# EAGLE design LoliBot (EAGLE 8.3.2)
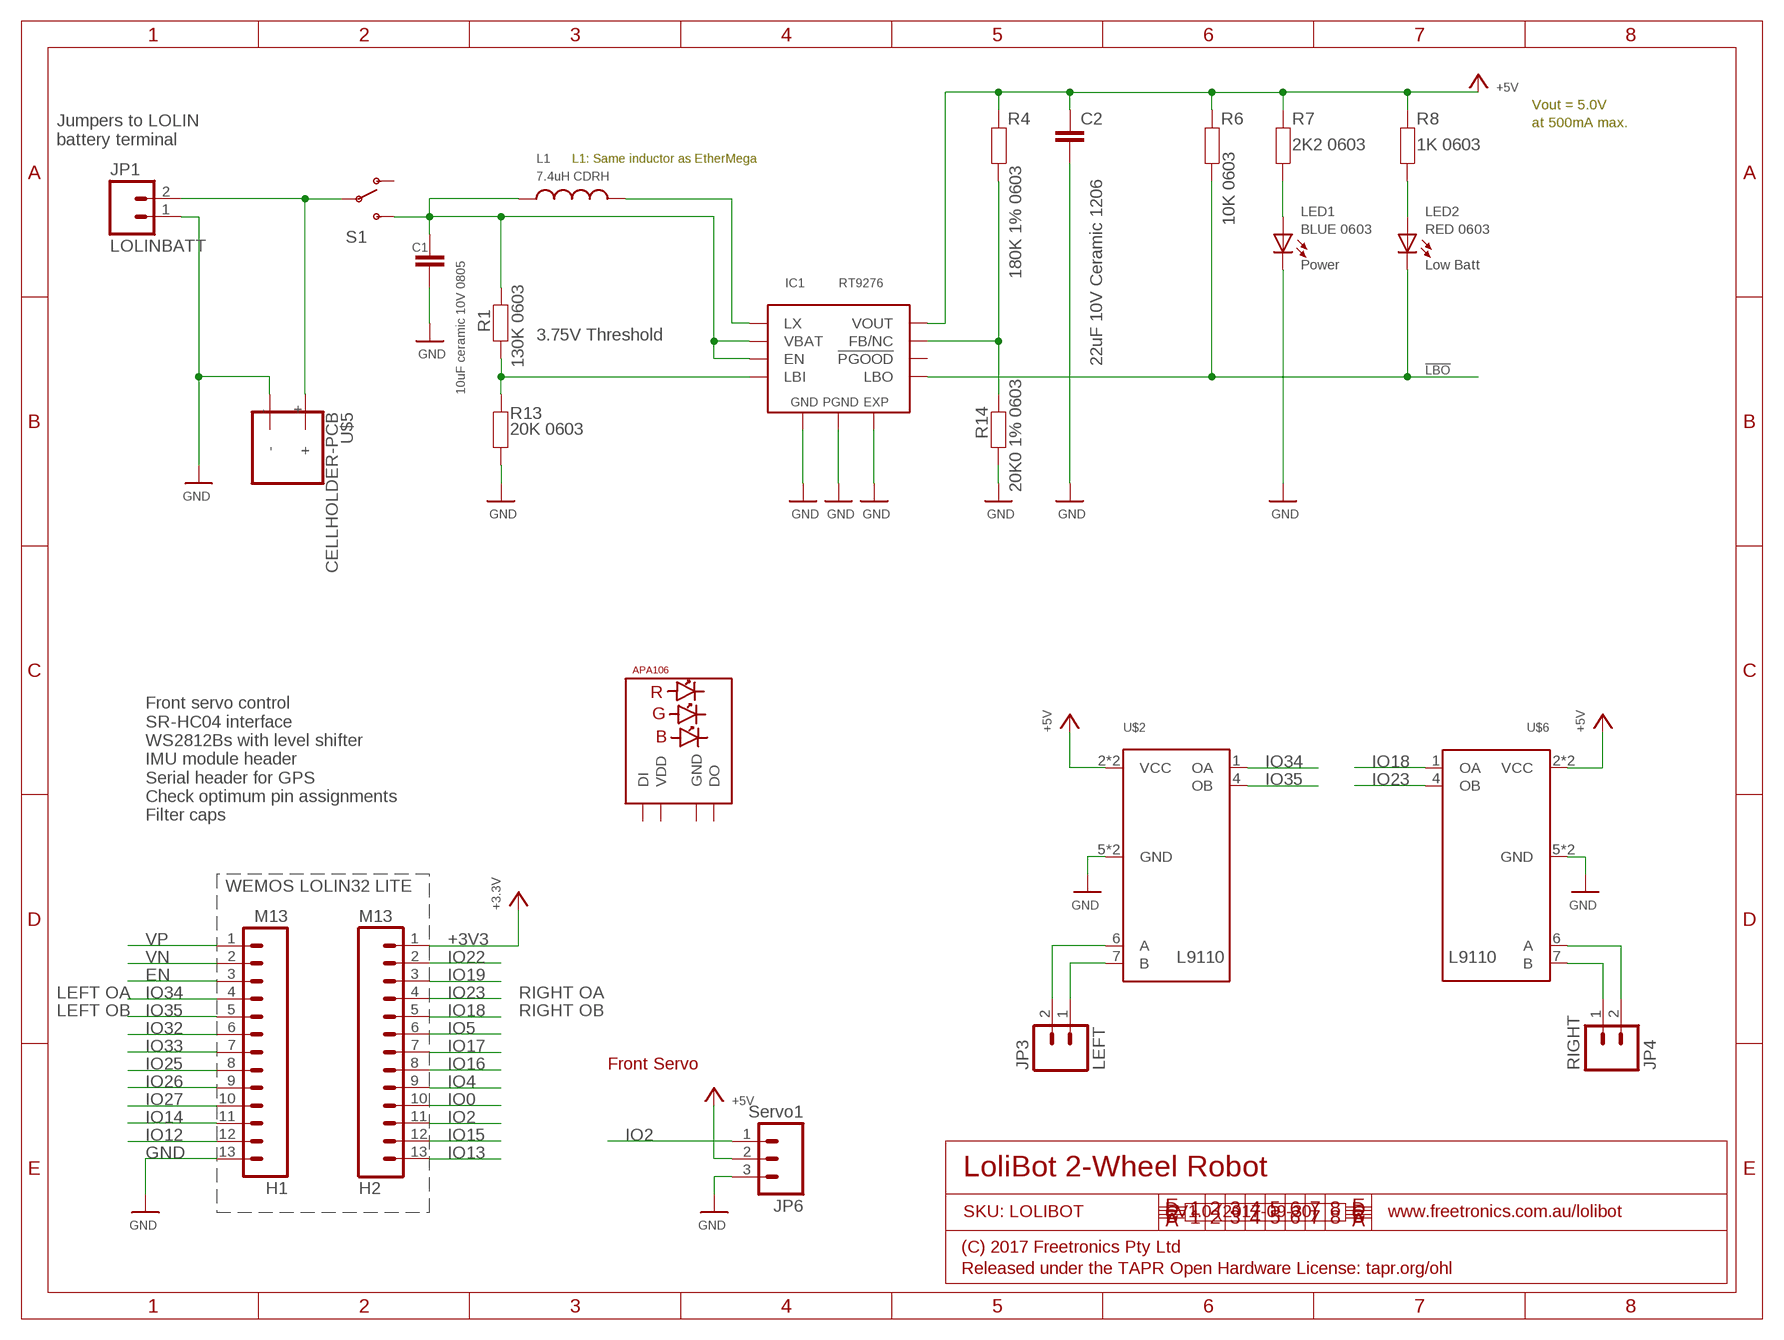
[diagram p0: schematic, sheet 1]

## Parts
C1  10uF ceramic 10V 0805  C-EUC0805  [C0805]
C2  22uF 10V Ceramic 1206  C-EUC1206K  [C1206K]
H1  M13  [1X13]
H2  M13  [1X13]
IC1  RT9276  [WDFN-10L-3X3]
JP1  LOLINBATT  M023.5MM  [SCREWTERMINAL-3.5MM-2]
JP3  LEFT  M023.5MM  [SCREWTERMINAL-3.5MM-2]
JP4  RIGHT  M023.5MM  [SCREWTERMINAL-3.5MM-2]
JP6  Servo1  M03PTH  [1X03]
L1  7.4uH CDRH  INDUCTOR  [CDRH]
LED1  BLUE 0603  LED0603  [LED-0603]
LED2  RED 0603  LED0603  [LED-0603]
R1  130K 0603  RESISTOR0603  [0603]
R4  180K 1% 0603  RESISTOR0603  [0603]
R6  10K 0603  RESISTOR0603  [0603]
R7  2K2 0603  RESISTOR0603  [0603]
R8  1K 0603  RESISTOR0603  [0603]
R13  20K 0603  RESISTOR0603  [0603]
R14  20K0 1% 0603  RESISTOR0603  [0603]
S1  SWITCH-SPSTPTH  [SWITCH-SPDT]
U$1  APA106F8  [LED8MMRGB]
U$2  L9110SO8  [SO08]
U$5  CELLHOLDER-PCB  [BH-18650-PC]
U$6  L9110SO8  [SO08]

## Nets
!LBO: IC1.4(LBO) LED2.C R6.2
+3V3: H2.1 ; supply symbol labelled +3.3V
+5V: C2.1 IC1.2(VOUT) JP6.2 R4.1 R6.1 R7.1 R8.1 U$2.2(VCC) U$2.3(VCC) U$6.2(VCC) U$6.3(VCC)
EN: H1.3
FB: IC1.3(FB/NC) R4.2 R14.2
GND: C1.2 C2.2 H1.13 IC1.5(GND) IC1.10(PGND) IC1.EXP JP1.1 JP6.3 LED1.C R13.1 R14.1 U$2.5(GND) U$2.8(GND) U$5.- U$6.5(GND) U$6.8(GND)
IO0: H2.10
IO2: H2.11 JP6.1
IO4: H2.9
IO5: H2.6
IO12: H1.12
IO13: H2.13
IO14: H1.11
IO15: H2.12
IO16: H2.8
IO17: H2.7
IO18: H2.5 U$6.1(OA)
IO19: H2.3
IO22: H2.2
IO23: H2.4 U$6.4(OB)
IO25: H1.8
IO26: H1.9
IO27: H1.10
IO32: H1.6
IO33: H1.7
IO34: H1.4 U$2.1(OA)
IO35: H1.5 U$2.4(OB)
LBI: IC1.7(LBI) R1.1 R13.2
LX: IC1.9(LX) L1.2
N$1: JP3.1 U$2.7(B)
N$2: JP3.2 U$2.6(A)
N$3: JP4.1 U$6.7(B)
N$4: JP4.2 U$6.6(A)
N$5: JP1.2 S1.2(P) U$5.+
N$8: LED1.A R7.2
N$35: LED2.A R8.2
VBAT: C1.1 IC1.1(EN) IC1.6(VBAT) L1.1 R1.2 S1.3(S)
VN: H1.2
VP: H1.1
Unconnected: IC1.8(!PGOOD) S1.1(O) U$1.1(DO) U$1.4(DI)

## Notes on the sheet
- Vout = 5.0V
- at 500mA max.
- Jumpers to LOLIN
  battery terminal
- L1: Same inductor as EtherMega
- Power | Low Batt
- 3.75V Threshold
- Front servo control
  SR-HC04 interface
  WS2812Bs with level shifter
  IMU module header
  Serial header for GPS
  Check optimum pin assignments
  Filter caps
- WEMOS LOLIN32 LITE
- LEFT OA | RIGHT OA
- LEFT OB | RIGHT OB
- Front Servo
- LoliBot 2-Wheel Robot
- SKU: LOLIBOT | V1.0 (2017-09-30) | www.freetronics.com.au/lolibot
- (C) 2017 Freetronics Pty Ltd
- Released under the TAPR Open Hardware License: tapr.org/ohl

## Power pins joined to a net without a drawn wire
GND: U$1.2(GND)
VDD: U$1.3(VDD)

## Library data of the parts
C1 C2 = freetronics-jon:C-EU: CAPACITOR, European symbol
H1 H2 = freetronics-original:M13
IC1 = freetronics-luke:RT9276: Richtek RT9276 boost converter. www.richtek.com/download_ds.jsp?s=631
JP1 JP3 JP4 = freetronics-jon:M02: Header 2 Standard 2-pin 0.1" header. Use with straight break away headers (SKU : PRT-00116), right angle break away headers (PRT-00553), swiss pins (PRT-00743), machine pins (PRT-00117), and female headers (PRT-00115). Molex polarized connector foot print use with SKU : PRT-08233 with associated crimp pins and housings.
JP6 = freetronics-master-v1.1:M03: Header 3 Standard 3-pin 0.1" header. Use with straight break away headers (SKU : PRT-00116), right angle break away headers (PRT-00553), swiss pins (PRT-00743), machine pins (PRT-00117), and female headers (PRT-00115). Molex polarized connector foot print use with SKU : PRT-08232 with associated crimp pins and housings.
L1 = freetronics-luke:INDUCTOR
LED1 LED2 = freetronics-master-v1:LED: LEDs Standard schematic elements and footprints for 5mm, 3mm, 1206, and 0603 sized LEDs. 5mm - Spark Fun Electronics SKU : COM-00529 (and others)
R1 = freetronics-master-v1.1:RESISTOR: Resistor Basic schematic elements and footprints for 0603, 1206, and PTH 1/10th watt (small) resistors.
R4 R6-R8 R13 R14 = freetronics-original:RESISTOR: Resistor Basic schematic elements and footprints for 0603, 1206, and PTH 1/10th watt (small) resistors.
S1 = freetronics-original:SWITCH-SPST: SPST Switch Simple slide switch. Spark Fun Electronics SKU : COM-00102
U$1 = freetronics-jon:APA106
U$2 U$6 = freetronics-jon:L9110
U$5 = freetronics-jon:CELLHOLDER-PCB

## Board
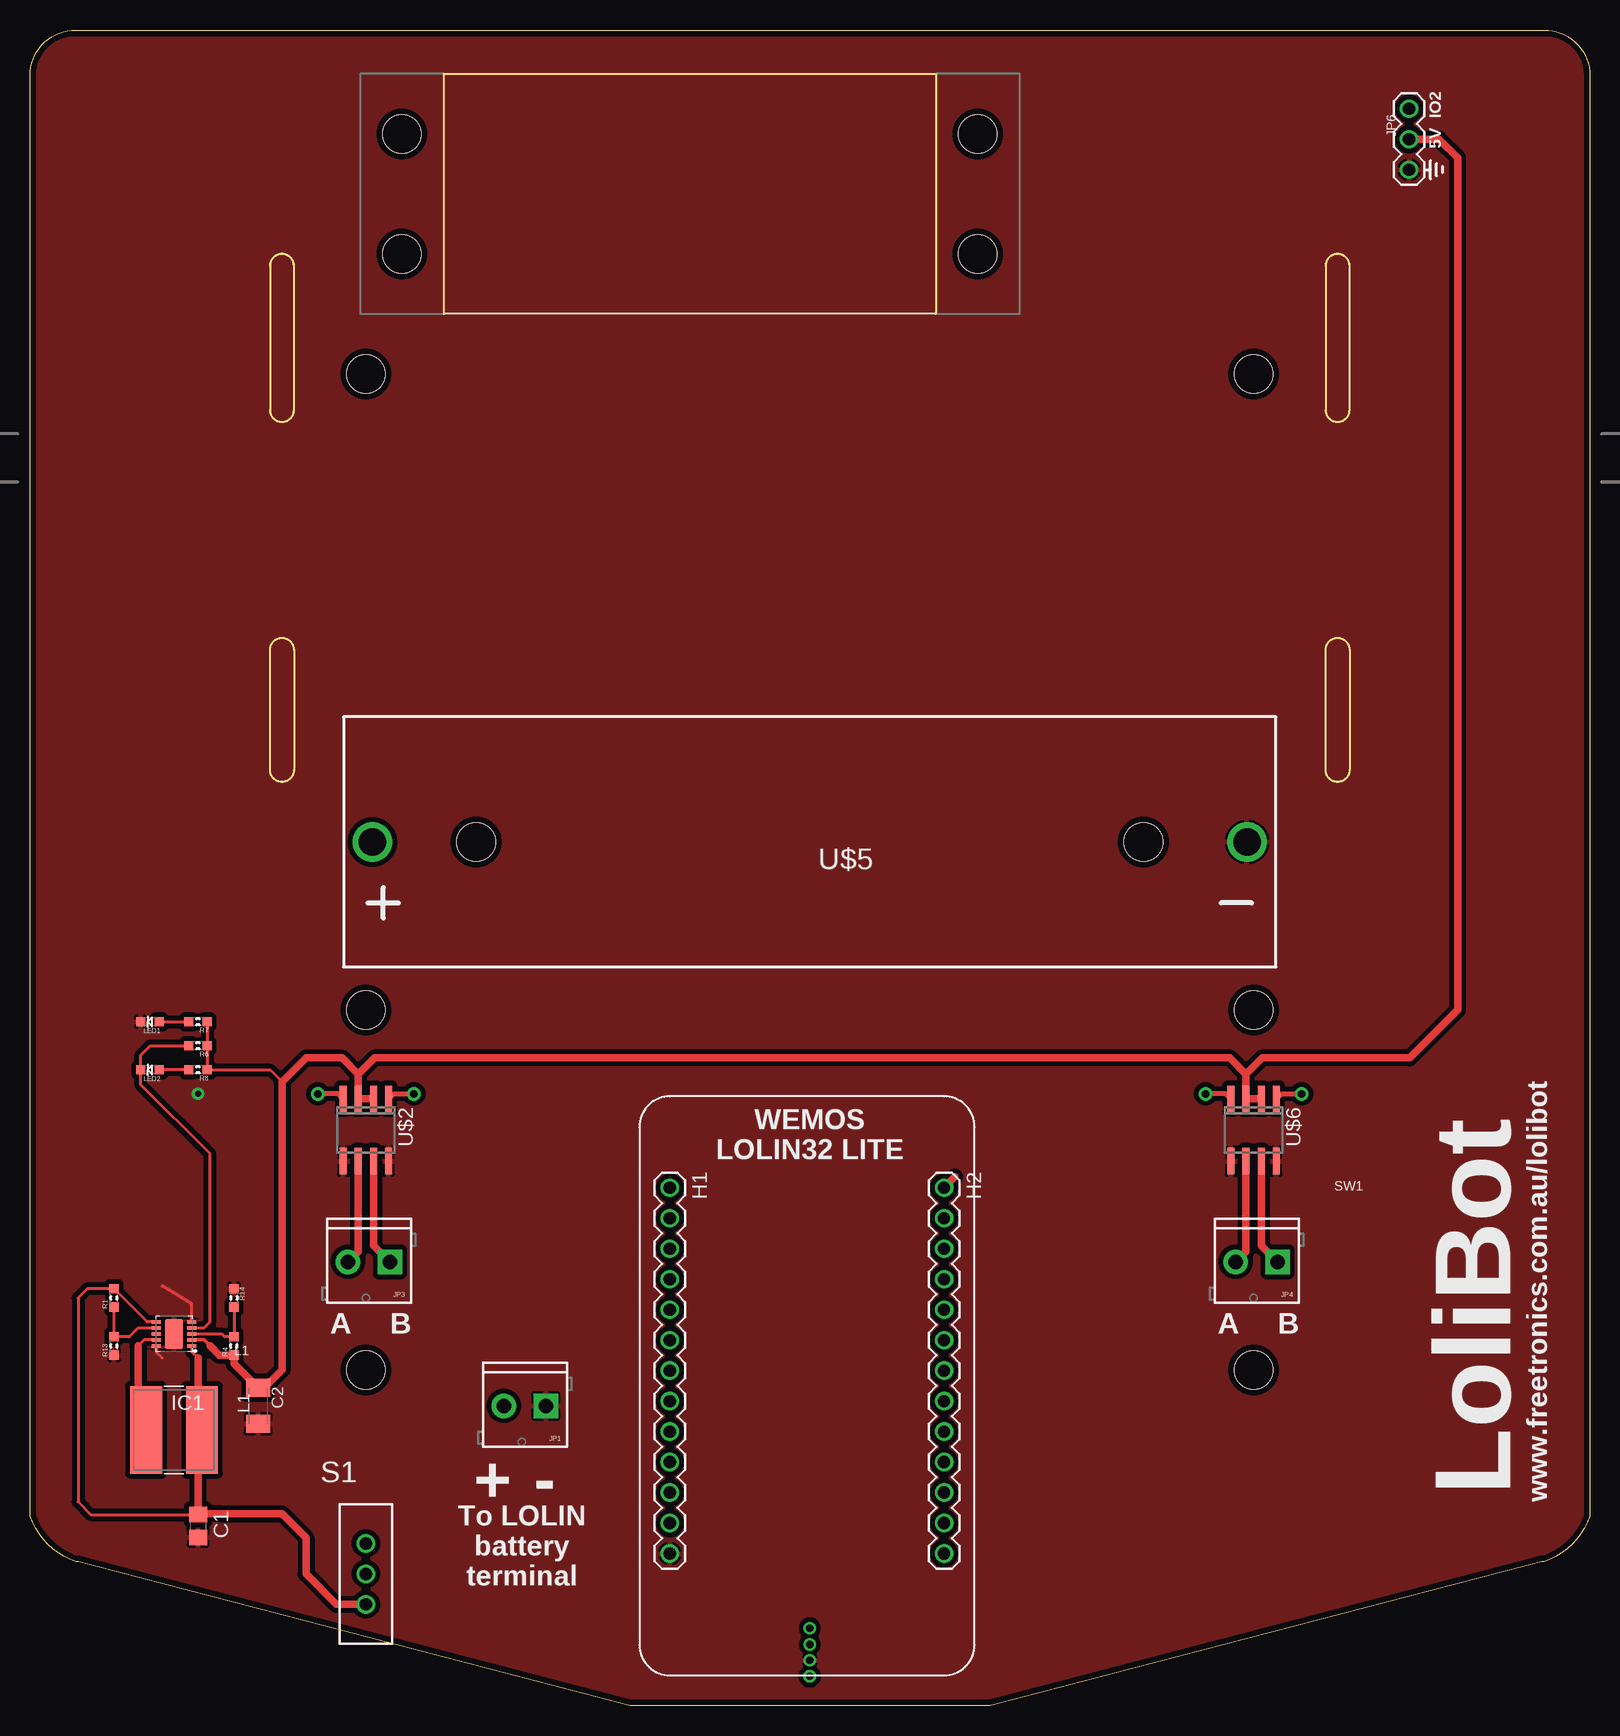
[diagram p1: board, top side]
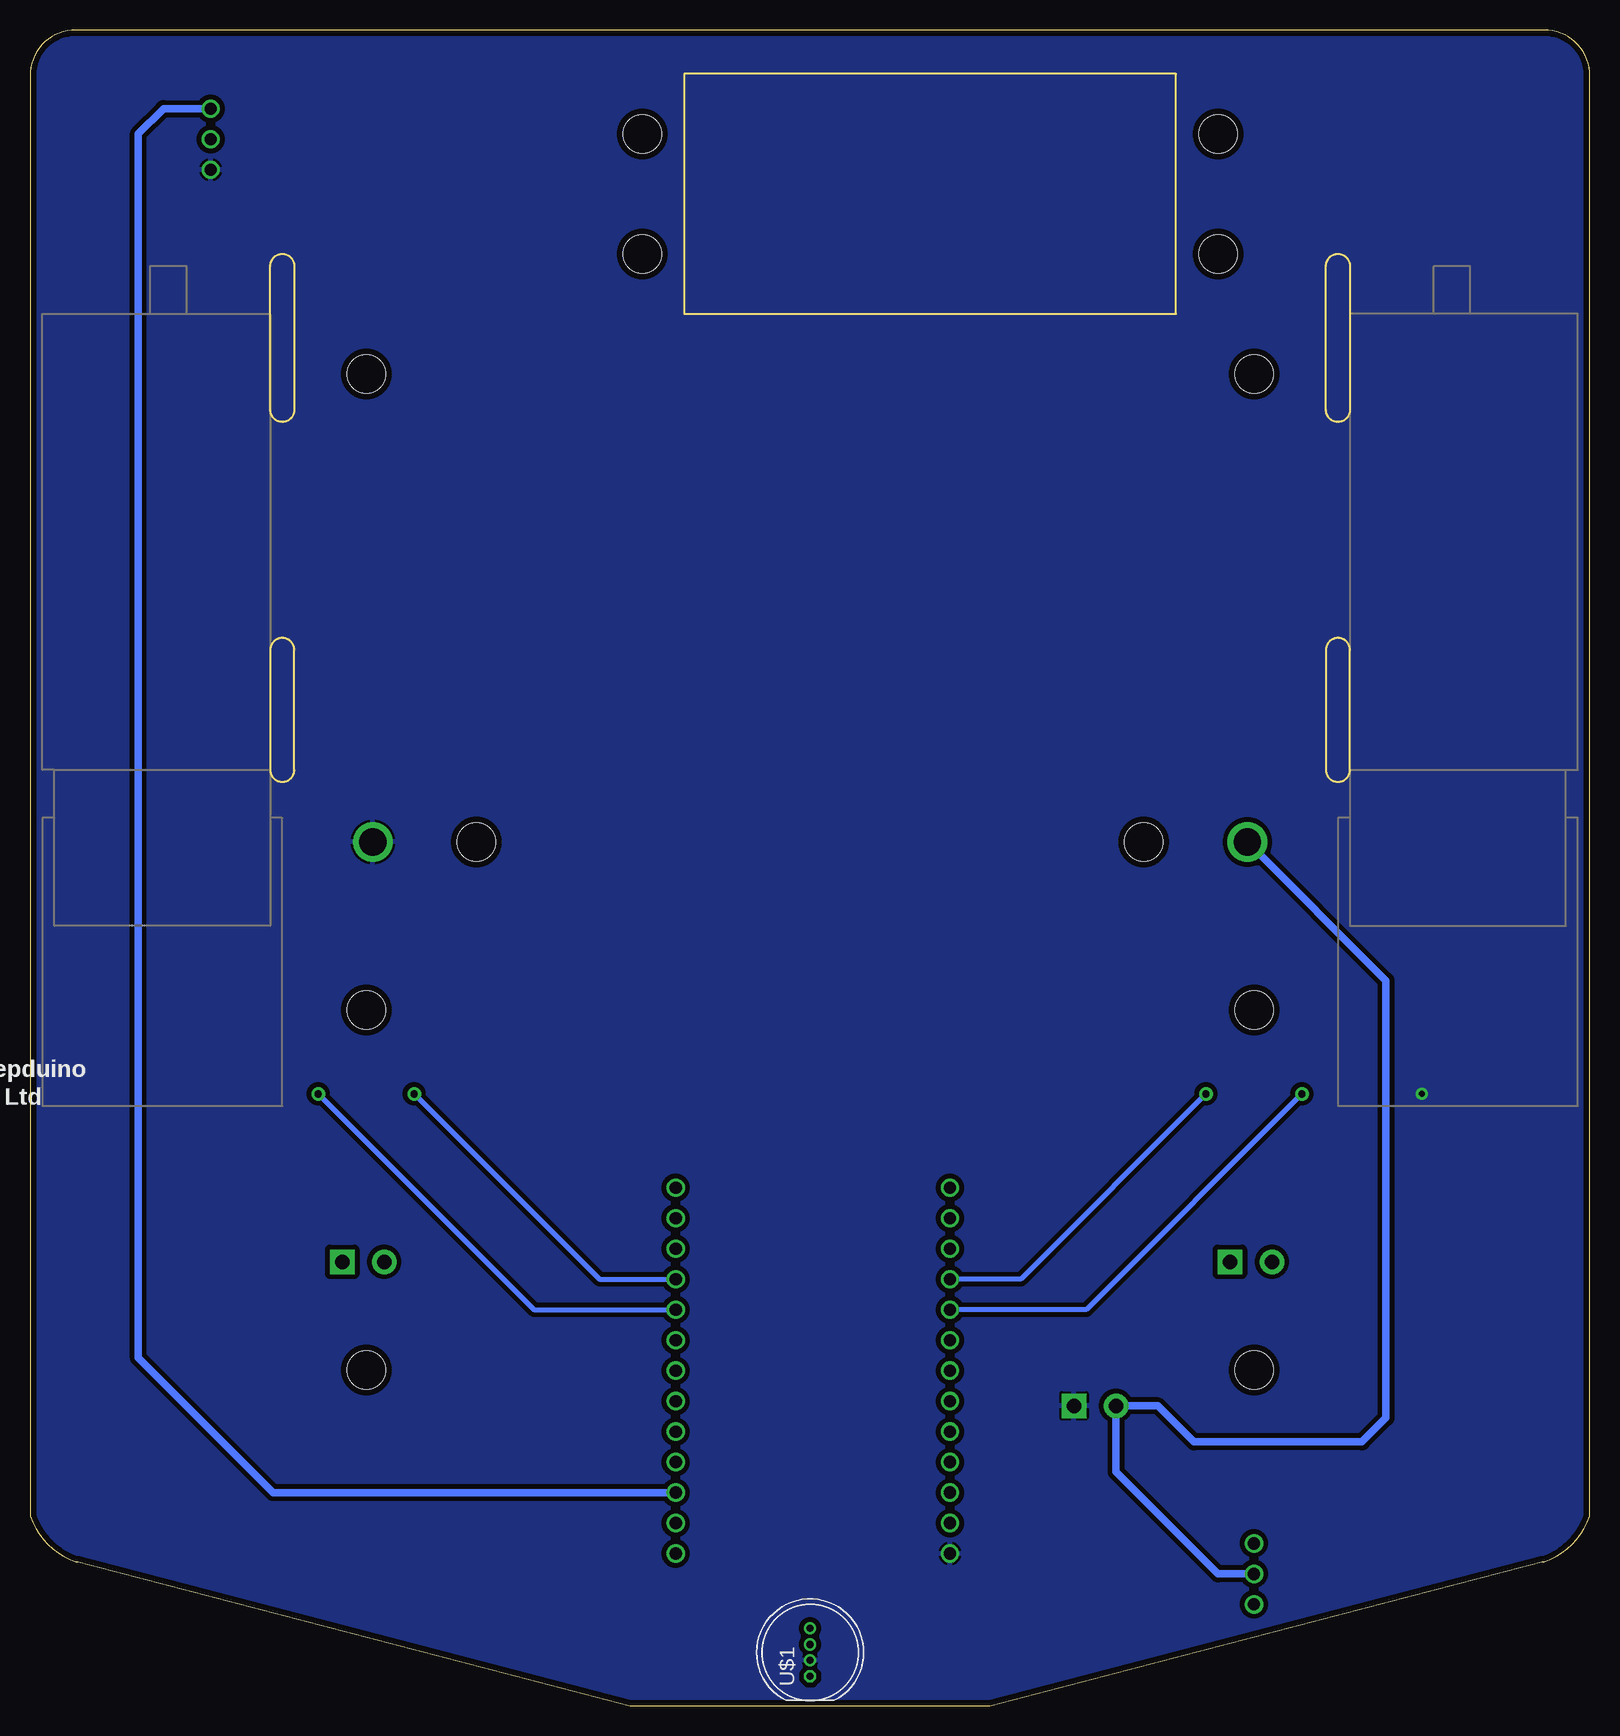
[diagram p2: board, bottom side, seen from below]

Size 130.03 x 139.66 mm. Coordinates in mm from the lower left corner, seen from the top.
Outline: 0,135.85 arc-90 3.81,139.66 126.22,139.66 arc-90 130.03,135.85 130.03,15.81 arc-50 126.22,12 126,12 80,0 50,0 4,12 3.81,12 arc-50 0,15.81 0,135.85
Copper layers (1*16): Top 0.035mm / dielectric 1.5mm / Bottom 0.035mm
Design rules "default": minimum track width 8mil, minimum drill 0.4mm, track to track 8mil, track to pad 8mil, pad to pad 8mil, via to via 8mil, smd to smd 8mil, copper to edge 20mil, drill to drill 8mil, minimum pad ring 8mil, minimum via ring 10mil, stop-mask expansion 3mil, vias tented up to drill 25mil, thermal gap 8mil
Holes 3.2 mm at 28,111 102,111 102,58 28,58 31,131 31,121 79,131 79,121 28,28 102,28
Milling: 20 lines

### Footprints (pad centres in the part's own frame; a part is rotated, then mirrored left to right if it is on the bottom)
C0805 = smd 1.3 x 1.5: 1 -0.95,0; 2 0.95,0
C1206K = smd 1.5 x 2: 1 -1.5,0; 2 1.5,0
1X13 = drill 1.016: 1 0,0; 2 2.54,0; 3 5.08,0; 4 7.62,0; 5 10.16,0; 6 12.7,0; 7 15.24,0; 8 17.78,0; 9 20.32,0; 10 22.86,0; 11 25.4,0; 12 27.94,0; 13 30.48,0
WDFN-10L-3X3 = smd 0.85 x 0.3: 1 -1.475,1; 2 -1.475,0.5; 3 -1.475,0; 4 -1.475,-0.5; 5 -1.475,-1; 6 1.475,-1; 7 1.475,-0.5; 8 1.475,0; 9 1.475,0.5; 10 1.475,1 | smd 1.5 x 2.5: EXP 0,0
SCREWTERMINAL-3.5MM-2 = drill 1.2 pad 2.032 square: 1 0,0 | drill 1.2 pad 2.032: 2 3.5,0
1X03 = drill 1.016: 1 0,0; 2 2.54,0; 3 5.08,0
CDRH = smd 7.3 x 2.65: 1 0,2.325; 2 0,-2.325
LED-0603 = smd 0.762 x 0.762: A -0.762,0; C 0.762,0
0603 = smd 0.762 x 0.762: 1 -0.762,0; 2 0.762,0
SWITCH-SPDT = drill 1.016: 1 0,2.54; 2 0,0; 3 0,-2.54
LED8MMRGB = drill 0.6 octagon: 1 -2,0 | drill 0.6: 2 -0.66,0; 3 0.66,0; 4 2,0
SO08 = smd 0.6 x 2.2: 1 -1.905,-2.6; 2 -0.635,-2.6; 3 0.635,-2.6; 4 1.905,-2.6; 5 1.905,2.6; 6 0.635,2.6; 7 -0.635,2.6; 8 -1.905,2.6
BH-18650-PC = drill 2.286: + 36.449,0; - -36.449,0 | hole 3.2: -27.813,0; 27.813,0

### Placement (x,y rotation side)
C1  14,15 270 top
C2  19,25 270 top
H1  53.34,43.18 270 top
H2  76.2,43.18 270 top
IC1  12,31 180 top
JP1  43,25 180 top
JP3  30,37 180 top
JP4  104,37 180 top
JP6  114.96,133.1 270 top
L1  12,23 270 top
LED1  10,57 180 top
LED2  10,53 180 top
R1  7,34 90 top
R4  17,30 90 top
R6  14,55 180 top
R7  14,57 180 top
R8  14,53 180 top
R13  7,30 90 top
R14  17,34 270 top
S1  28,11 0 top
U$1  65,4.46 90 bottom
U$2  28,48 180 top
U$5  65,72 180 top
U$6  102,48 180 top

### Tracks (layer width: path | path; a pad name or v marks a point on that pad's centre or on a via)
!LBO
  Top 0.254: R6.2 10,55 9.24,54.24 LED2.C 9.24,51.76 15,46 15,32 14.5,31.5 IC1.4
+3V3
  Top 0.61: 77.1,44.08 H2.1
+5V
  Top 0.254: 13.49,30.48 IC1.2 | R7.1 R6.1 R8.1 20,53 21,52
  Top 0.305: IC1.2 14.5,30.5 15,30
  Top 0.61: U$2.2 U$2.3 27.36,52.63 | U$6.2 U$6.3 101.36,52.63 | 15,30 15.76,29.24 R4.1 17,28.5 C2.1 19.5,26.5 21,28 21,52 23,54 26,54 27.36,52.63 | 27.36,52.63 28.73,54 100,54 101.36,52.63 | JP6.2 117.44,130.56 119,129 119,58 115,54 102.73,54 101.36,52.63
FB
  Top 0.254: IC1.3 16,31 16.24,30.76 R4.2 R14.2
GND  (via drill 0.5)
  Top 0.254: IC1.5 13.47,33.52 11,35 | IC1.10 10.53,29.48 11,29
  other vias: 14,51
  pour Top (isolate 0.406): 3.81,139.66 126.22,139.66 arc-90 130.03,135.85 130.03,15.81 arc-50 126.22,12 126,12 80,0 50,0 4,12 3.81,12 arc-50 0,15.81 0,135.85 arc-90
  pour Bottom (isolate 0.406): 3.81,139.66 126.22,139.66 arc-90 130.03,135.85 130.03,15.81 arc-50 126.22,12 126,12 80,0 50,0 4,12 3.81,12 arc-50 0,15.81 0,135.85 arc-90
IO2
  Bottom 0.61: H2.11 109.78,17.78 121,29 121,131 118.9,133.1 JP6.1
IO18  (via drill 0.6)
  Top 0.406: U$6.1 104.31,51 v106,51
  Bottom 0.406: H2.5 88.02,33.02 v106,51
IO23  (via drill 0.6)
  Top 0.406: U$6.4 99.69,51 v98,51
  Bottom 0.406: v98,51 82.56,35.56 H2.4
IO34  (via drill 0.6)
  Top 0.406: U$2.1 30.3,51 v32,51
  Bottom 0.406: v32,51 47.44,35.56 H1.4
IO35  (via drill 0.6)
  Top 0.406: U$2.4 25.7,51 v24,51
  Bottom 0.406: v24,51 41.98,33.02 H1.5
LBI
  Top 0.254: R1.1 R13.2 8.27,30.76 8.99,31.48 10.51,31.48 IC1.7
LX
  Top 0.254: IC1.9 9.5,30.5 9,30
  Top 0.508: 9,23.68 L1.2
  Top 0.61: 9,30 9,23.68
N$1
  Top 0.61: U$2.7 28.64,38.37 JP3.1
N$2
  Top 0.61: U$2.6 27.36,37.87 JP3.2
N$3
  Top 0.61: U$6.7 102.64,38.37 JP4.1
N$4
  Top 0.61: U$6.6 101.36,37.87 JP4.2
N$5
  Bottom 0.61: S1.2 31,11 39.5,19.5 JP1.2 36,25 33,22 19,22 17,24 17,60.45 U$5.+
N$8
  Top 0.254: LED1.A R7.2
N$35
  Top 0.254: R8.2 LED2.A
VBAT
  Top 0.254: IC1.1 13.47,29.52 14,29 | IC1.6 9.76,32 R1.2 4.76,34.76 4,34 4,17 5.05,15.95 C1.1
  Top 0.508: L1.1 14,23.32 | 15.7,16 16,16
  Top 0.61: 14,29 14,23.32 | S1.3 25.54,8.46 23,11 23,14 21,16 16,16 14.05,16 C1.1 14,22.68 L1.1

### Text on the board
tPlace: IO2 | 5V | WEMOS / LOLIN32 LITE | A | B | A | B | LoliBot | + | - | www.freetronics.com.au/lolibot | To LOLIN / battery / terminal
bPlace: Arduino-compatible | LoliBot | www.freetronics.com/stepduino | (C) 2017 Freetronics Pty Ltd | Released under | the TAPR Open | Hardware License: | www.tapr.org/OHL
tNames: SW1 | L1